# Altium schematic sheet USB-Ethernet 100M SR9900A.SchDoc
size A4; SheetNumber: 11; SheetTotal: 11
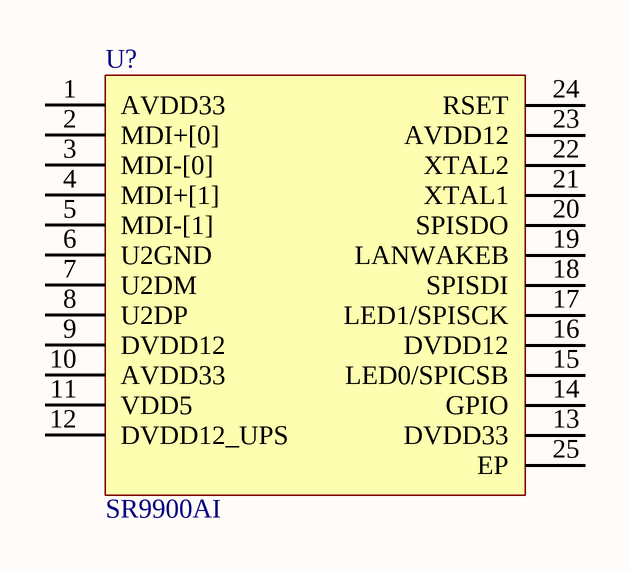
[diagram p0: USB-Ethernet 100M SR9900A.SchDoc]

## Parts
U?  SR9900AI  [QFN50P400X400X80_HS-25N]

## Nets

Not connected (* = marked no-connect by the designer): U? 1(AVDD33) 2(MDI+[0]) 3(MDI-[0]) 4(MDI+[1]) 5(MDI-[1]) 6(U2GND) 7(U2DM) 8(U2DP) 9(DVDD12) 10(AVDD33) 11(VDD5) 12(DVDD12_UPS) 13(DVDD33) 14(GPIO) 15(LED0/SPICSB) 16(DVDD12) 17(LED1/SPISCK) 18(SPISDI) 19(LANWAKEB) 20(SPISDO) 21(XTAL1) 22(XTAL2) 23(AVDD12) 24(RSET) 25(EP)

## Library data of the parts
U? = SR9900AI: MANUFACTURER: CoreChips; Part Number: SR9900AI; COMPONENTLINK1URL: https://datasheet.lcsc.com/lcsc/2202082100_CoreChips-SR9900A_C521278.pdf; COMPONENTLINK1DESCRIPTION: Datasheet; PACKAGE: QFN-24EP; Part Status: Active